# EAGLE schematic Sprite Sail 2 Layer (EAGLE 9.0.0)
Assembly variants: hdmid
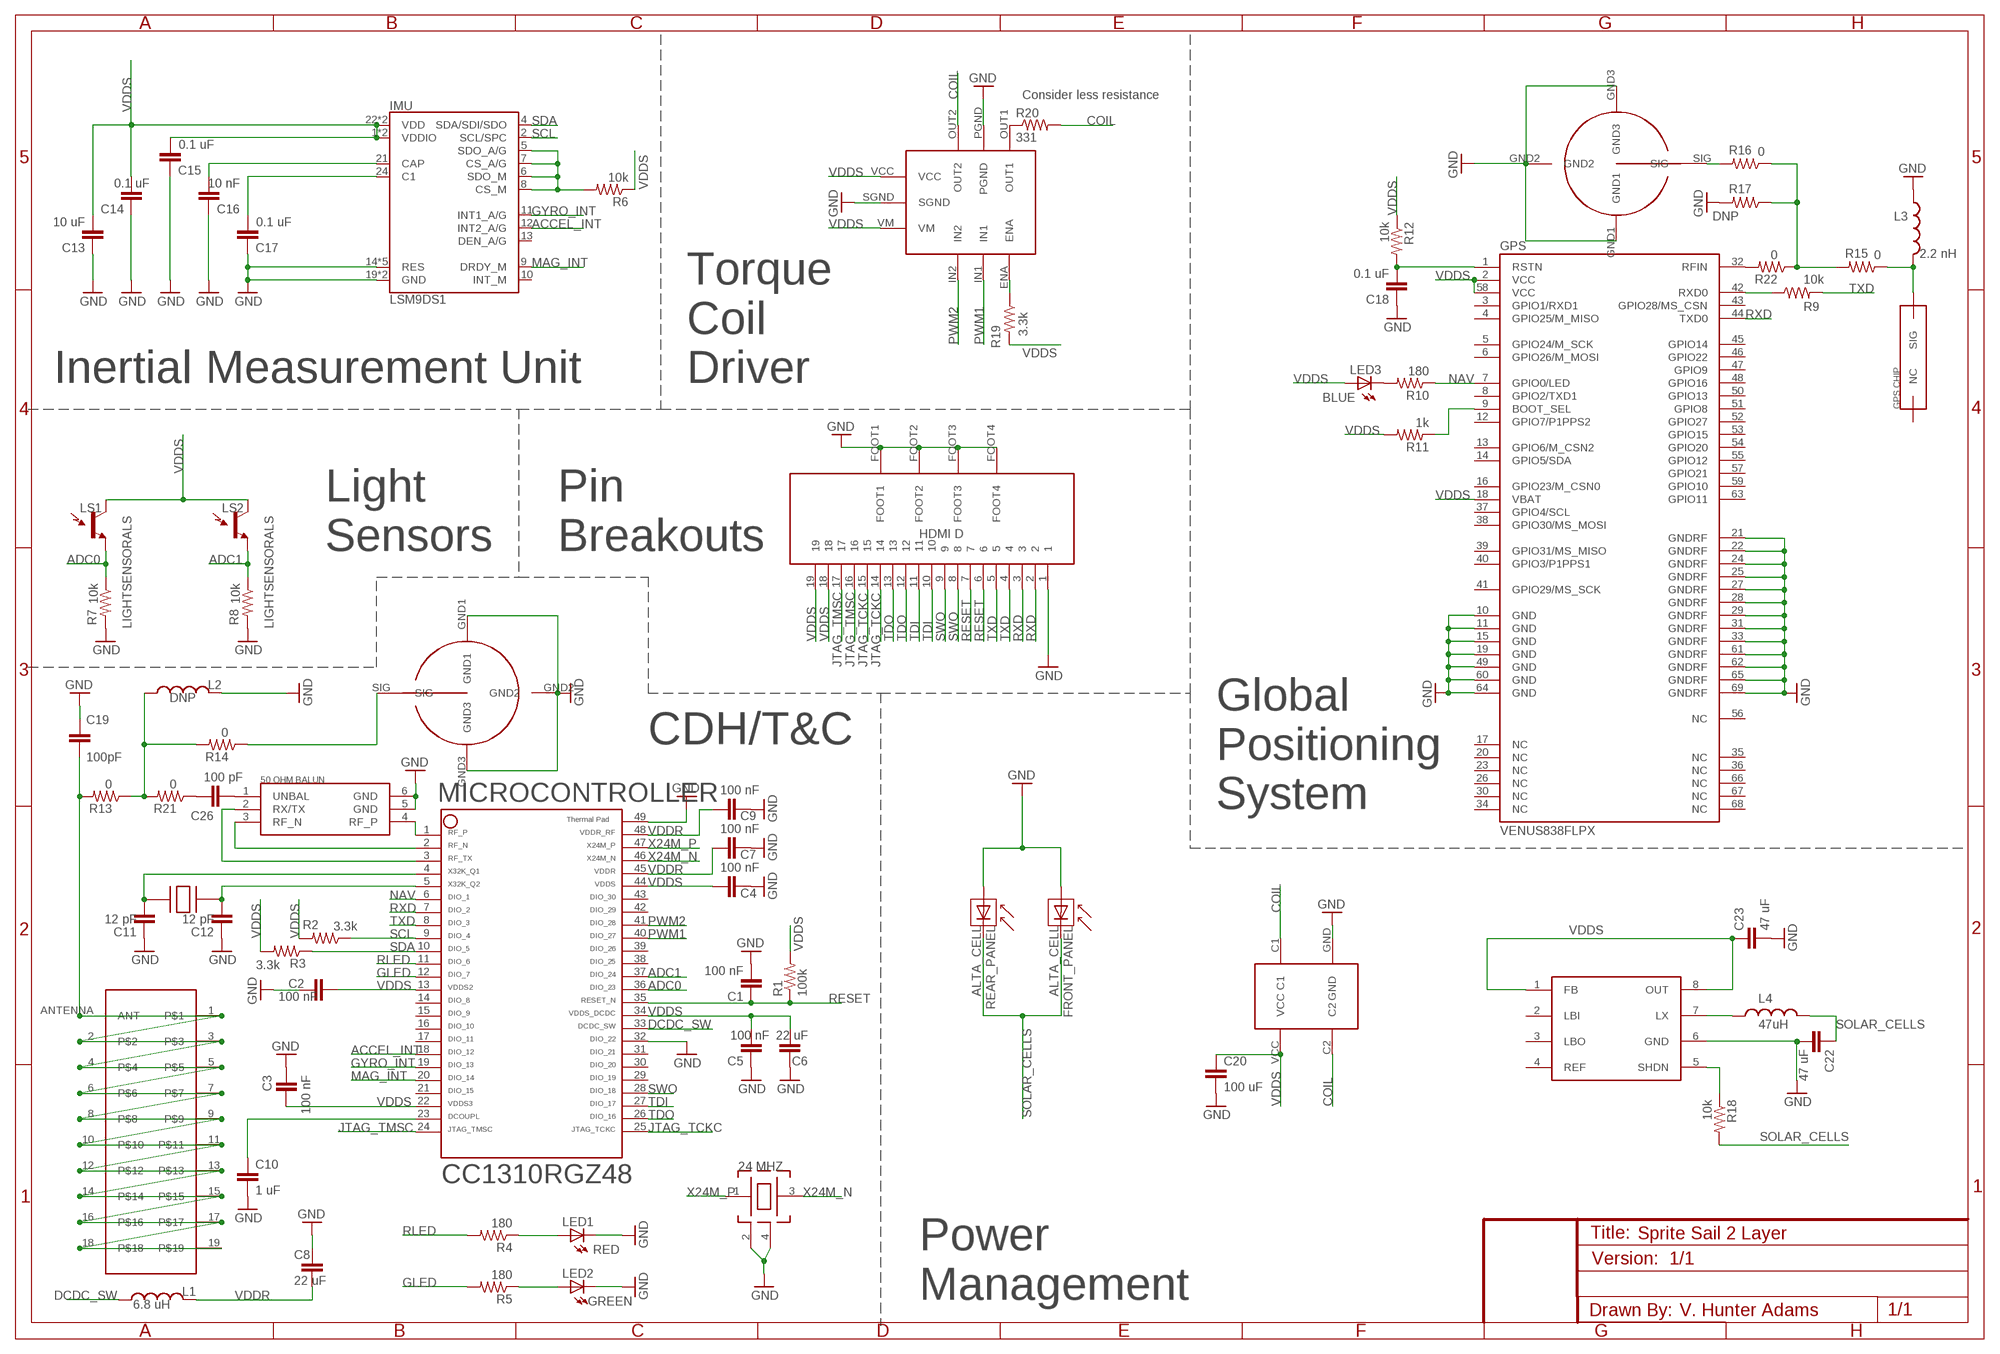
[diagram p0: schematic, sheet 1]

## Parts
32.768  FC-135  [FC-135]
BALUN  JOHANSON_BALUN  [JOHANSON_BALUN]
C1  100 nF  CAP0402-CAP  [0402-CAP]
C2  100 nF  CAP0402-CAP  [0402-CAP]
C3  100 nF  CAP0402-CAP  [0402-CAP]
C4  100 nF  CAP0402-CAP  [0402-CAP]
C5  100 nF  CAP0402-CAP  [0402-CAP]
C6  22 uF  CAP0402-CAP  [0402-CAP]
C7  100 nF  CAP0402-CAP  [0402-CAP]
C8  22 uF  CAP0402-CAP  [0402-CAP]
C9  100 nF  CAP0402-CAP  [0402-CAP]
C10  1 uF  CAP0402-CAP  [0402-CAP]
C11  12 pF  CAP0402-CAP  [0402-CAP]
C12  12 pF  CAP0402-CAP  [0402-CAP]
C13  10 uF  CAP0402-CAP  [0402-CAP]
C14  0.1 uF  CAP0402-CAP  [0402-CAP]
C15  0.1 uF  CAP0402-CAP  [0402-CAP]
C16  10 nF  CAP0402-CAP  [0402-CAP]
C17  0.1 uF  CAP0402-CAP  [0402-CAP]
C18  0.1 uF  CAP0402-CAP  [0402-CAP]
C19  100pF  CAP0603-CAP  [0603-CAP]
C20  100 uF  CAP0805  [0805]
C22  47 uF  CAP0805  [0805]
C23  47 uF  CAP0805  [0805]
C26  100 pF  CAP0402-CAP  [0402-CAP]
FRONT_PANEL  ALTA_CELL  [ALTA_CELL]
GPS  VENUS838FLPX  [VENUS838FLPX]
IMU  LSM9DS1  [LGA24-8X4]
L1  6.8 uH  INDUCTOR0603  [0603]
L2  DNP  INDUCTOR0603  [0603]
L3  2.2 nH  INDUCTOR0603  [0603]
L4  47uH  INDUCTOR0603  [0603]
LED1  RED  LED0603  [LED-0603]
LED2  GREEN  LED0603  [LED-0603]
LED3  BLUE  LED0603  [LED-0603]
LS1  LIGHTSENSORALS  [ALS-PT19]
LS2  LIGHTSENSORALS  [ALS-PT19]
MICROCONTROLLER  CC1310  [CC1310]
R1  100k  RESISTOR0402-RES  [0402-RES]
R2  3.3k  RESISTOR0402-RES  [0402-RES]
R3  3.3k  RESISTOR0402-RES  [0402-RES]
R4  180  RESISTOR0402-RES  [0402-RES]
R5  180  RESISTOR0402-RES  [0402-RES]
R6  10k  RESISTOR0402-RES  [0402-RES]
R7  10k  RESISTOR0402-RES  [0402-RES]
R8  10k  RESISTOR0402-RES  [0402-RES]
R9  10k  RESISTOR0402-RES  [0402-RES]
R10  180  RESISTOR0402-RES  [0402-RES]
R11  1k  RESISTOR0402-RES  [0402-RES]
R12  10k  RESISTOR0402-RES  [0402-RES]
R13  0  RESISTOR0603-RES  [0603-RES]
R14  0  RESISTOR0603-RES  [0603-RES]
R15  0  RESISTOR0603-RES  [0603-RES]
R16  0  RESISTOR0603-RES  [0603-RES]
R17  DNP  RESISTOR0603-RES  [0603-RES]
R18  10k  RESISTOR0402-RES  [0402-RES]
R19  3.3k  RESISTOR0402-RES  [0402-RES]
R20  331  RESISTOR0402-RES  [0402-RES]
R21  0  RESISTOR0603-RES  [0603-RES]
R22  0  RESISTOR0603-RES  [0603-RES]
REAR_PANEL  ALTA_CELL  [ALTA_CELL]
TSX3225  TSX-3225  [TSX-3225]
U$2  LV8417CS  [LV8417CS]
U$3  MM5329-2700  [MM5829-2700]
U$4  PANASONIC_RECTIFIER  [PANASONIC_RECTIFIER]
U$5  JOHANSON_GPS_CHIP  [JOHANSON_GPS_CHIP]
U$6  PCB_ANTENNA  [PCB_ANTENNA]
U$7  MM5329-2700  [MM5829-2700]
U$8  L6920  [L6920]
U$9  HDMID  [HDMID]

## Nets
ACCEL_INT: IMU.12(INT2_A/G) MICROCONTROLLER.18
ADC0: LS1.E(E1) MICROCONTROLLER.36 R7.1
ADC1: LS2.E(E1) MICROCONTROLLER.37 R8.1
ANTENNA: C19.2 R13.2 U$6.1 U$6.2 U$6.3 U$6.4 U$6.5 U$6.6 U$6.7 U$6.8 U$6.9 U$6.10 U$6.11 U$6.12 U$6.13 U$6.14 U$6.15 U$6.16 U$6.17 U$6.18 U$6.19 U$6.ANTENNA(ANT)
COIL: R20.2 U$2.OUT2 U$4.C1 U$4.C2
DCDC_SW: L1.1 MICROCONTROLLER.33
GLED: MICROCONTROLLER.12 R5.2
GND: BALUN.5(GND) BALUN.6(GND) C1.2 C2.2 C3.2 C4.2 C5.2 C6.2 C7.2 C8.2 C9.2 C10.2 C11.2 C12.2 C13.2 C14.2 C15.2 C16.2 C17.2 C18.2 C19.1 C20.2 C22.2 C23.2 FRONT_PANEL.- GPS.10(GND) GPS.11(GND) GPS.15(GND) GPS.19(GND) GPS.21(GNDRF) GPS.22(GNDRF) GPS.24(GNDRF) GPS.25(GNDRF) GPS.27(GNDRF) GPS.28(GNDRF) GPS.29(GNDRF) GPS.31(GNDRF) GPS.33(GNDRF) GPS.49(GND) GPS.60(GND) GPS.61(GNDRF) GPS.62(GNDRF) GPS.64(GND) GPS.65(GNDRF) GPS.69(GNDRF) IMU.14(RES) IMU.15(RES) IMU.16(RES) IMU.17(RES) IMU.18(RES) IMU.19(GND) IMU.20(GND) L2.2 L3.1 LED1.C LED2.C MICROCONTROLLER.32 MICROCONTROLLER.49 R7.2 R8.2 R17.2 REAR_PANEL.- TSX3225.2 TSX3225.4 U$2.PGND U$2.SGND U$3.GND1 U$3.GND2 U$3.GND3 U$4.GND U$7.GND1 U$7.GND2 U$7.GND3 U$8.6(GND) U$9.1 U$9.FOOT1 U$9.FOOT2 U$9.FOOT3 U$9.FOOT4
GYRO_INT: IMU.11(INT1_A/G) MICROCONTROLLER.19
JTAG_TCKC: MICROCONTROLLER.25 U$9.14 U$9.15
JTAG_TMSC: MICROCONTROLLER.24 U$9.16 U$9.17
MAG_INT: IMU.9(DRDY_M) MICROCONTROLLER.20
N$1: C10.1 MICROCONTROLLER.23
N$2: 32.768.P2 C11.1 MICROCONTROLLER.4
N$3: 32.768.P1 C12.1 MICROCONTROLLER.5
N$4: LED1.A R4.1
N$5: LED2.A R5.1
N$6: IMU.5(SDO_A/G) IMU.6(SDO_M) IMU.7(CS_A/G) IMU.8(CS_M) R6.2
N$7: GPS.42(RXD0) R9.1
N$8: C16.1 IMU.21(CAP)
N$9: C17.1 IMU.24(C1)
N$11: LED3.C R10.2
N$12: GPS.9(BOOT_SEL) R11.1
N$13: C18.1 GPS.1(RSTN) R12.2
N$14: R15.2 R16.1 R17.1 R22.1
N$15: L3.2 R15.1 U$5.SIG
N$16: R16.2 U$7.SIG
N$19: R19.1 U$2.ENA
N$20: R20.1 U$2.OUT1
N$21: BALUN.1(UNBAL) C26.2
N$22: BALUN.4(RF_P) MICROCONTROLLER.1
N$23: BALUN.3(RF_N) MICROCONTROLLER.2
N$24: BALUN.2(RX/TX) MICROCONTROLLER.3
N$25: GPS.32(RFIN) R22.2
N$26: L2.1 R13.1 R14.2 R21.2
N$27: C26.1 R21.1
N$40: R14.1 U$3.SIG
N$41: R18.1 U$8.5(SHDN)
N$48: L4.1 U$8.7(LX)
NAV: GPS.7(GPIO0/LED) MICROCONTROLLER.6 R10.1
PWM1: MICROCONTROLLER.40 U$2.IN1
PWM2: MICROCONTROLLER.41 U$2.IN2
RESET: C1.1 MICROCONTROLLER.35 R1.1 U$9.6 U$9.7
RLED: MICROCONTROLLER.11 R4.2
RXD: GPS.44(TXD0) MICROCONTROLLER.7 U$9.2 U$9.3
SCL: IMU.2(SCL/SPC) MICROCONTROLLER.9 R2.1
SDA: IMU.4(SDA/SDI/SDO) MICROCONTROLLER.10 R3.1
SOLAR_CELLS: C22.1 FRONT_PANEL.+ L4.2 R18.2 REAR_PANEL.+
SWO: MICROCONTROLLER.28 U$9.8 U$9.9
TDI: MICROCONTROLLER.27 U$9.10 U$9.11
TDO: MICROCONTROLLER.26 U$9.12 U$9.13
TXD: MICROCONTROLLER.8 R9.2 U$9.4 U$9.5
VDDR: C7.1 C8.1 C9.1 L1.2 MICROCONTROLLER.45 MICROCONTROLLER.48
VDDS: C2.1 C3.1 C4.1 C5.1 C6.1 C13.1 C14.1 C15.1 C20.1 C23.1 GPS.2(VCC) GPS.18(VBAT) GPS.58(VCC) IMU.1(VDDIO) IMU.3(VDDIO) IMU.22(VDD) IMU.23(VDD) LED3.A LS1.C(C1) LS2.C(C1) MICROCONTROLLER.13 MICROCONTROLLER.22 MICROCONTROLLER.34 MICROCONTROLLER.44 R1.2 R2.2 R3.2 R6.1 R11.2 R12.1 R19.2 U$2.VCC U$2.VM U$4.VCC U$8.1(FB) U$8.8(OUT) U$9.18 U$9.19
X24M_N: MICROCONTROLLER.46 TSX3225.3
X24M_P: MICROCONTROLLER.47 TSX3225.1
Unconnected: GPS.3(GPIO1/RXD1) GPS.4(GPIO25/M_MISO) GPS.5(GPIO24/M_SCK) GPS.6(GPIO26/M_MOSI) GPS.8(GPIO2/TXD1) GPS.12(GPIO7/P1PPS2) GPS.13(GPIO6/M_CSN2) GPS.14(GPIO5/SDA) GPS.16(GPIO23/M_CSN0) GPS.17(NC) GPS.20(NC) GPS.23(NC) GPS.26(NC) GPS.30(NC) GPS.34(NC) GPS.35(NC) GPS.36(NC) GPS.37(GPIO4/SCL) GPS.38(GPIO30/MS_MOSI) GPS.39(GPIO31/MS_MISO) GPS.40(GPIO3/P1PPS1) GPS.41(GPIO29/MS_SCK) GPS.43(GPIO28/MS_CSN) GPS.45(GPIO14) GPS.46(GPIO22) GPS.47(GPIO9) GPS.48(GPIO16) GPS.50(GPIO13) GPS.51(GPIO8) GPS.52(GPIO27) GPS.53(GPIO15) GPS.54(GPIO20) GPS.55(GPIO12) GPS.56(NC) GPS.57(GPIO21) GPS.59(GPIO10) GPS.63(GPIO11) GPS.66(NC) GPS.67(NC) GPS.68(NC) IMU.10(INT_M) IMU.13(DEN_A/G) MICROCONTROLLER.14 MICROCONTROLLER.15 MICROCONTROLLER.16 MICROCONTROLLER.17 MICROCONTROLLER.21 MICROCONTROLLER.29 MICROCONTROLLER.30 MICROCONTROLLER.31 MICROCONTROLLER.38 MICROCONTROLLER.39 MICROCONTROLLER.42 MICROCONTROLLER.43 U$5.NC U$8.2(LBI) U$8.3(LBO) U$8.4(REF)

## Notes on the sheet
- Consider less resistance
- Inertial Measurement Unit
- Torque
  Coil
  Driver
- Light
  Sensors
- Pin
  Breakouts
- CDH/T&C
- Global
  Positioning
  System
- Power
  Management

## Library data of the parts
32.768 = FC-135:FC-135: FC-135 32.768KA-AG0
BALUN = JOHANSON_BALUN:JOHANSON_BALUN
C1-C20 C22 C23 C26 = SparkFun:CAP: Capacitor Standard 0603 ceramic capacitor, and 0.1" leaded capacitor.
FRONT_PANEL REAR_PANEL = ALTA_CELL:ALTA_CELL
GPS = VENUS838FLPX:VENUS838FLPX: Venus838FLPx-L
IMU = SparkFun-Sensors:LSM9DS1: LSM9DS1 3D accelerometer, gyroscope & magnetometer The LSM9DS1 is a system-in-package featuring a 3D digital linear acceleration sensor, a 3D digital angular rate sensor, and a 3D digital magnetic sensor. The LSM9DS1 has a linear acceleration full scale of ±2g/±4g/±8/±16 g, a magnetic field full scale of ±4/±8/±12/±16 gauss and an angular rate of ±245/±500/±2000 dps. The LSM9DS1 includes an I2 C serial bus interface supporting standard and fast mode (100 kHz and 400 kHz) and an SPI serial standard interface. Magnetic, accelerometer and gyroscope sensing can be enabled or set in power-down mode separately for smart power management. The LSM9DS1 is available in a plastic land grid array package (LGA) and it is guaranteed to operate over an extended temperature range from -40 °C to +85 °C.; PROD_ID: IC-12536
L1-L4 = SparkFun:INDUCTOR: Inductors Basic Inductor/Choke - 0603 and 1206. Footprints are not proven and vary greatly between part numbers.
LED1-LED3 = SparkFun:LED: LEDs Standard schematic elements and footprints for 5mm, 3mm, 1206, and 0603 sized LEDs. 5mm - Spark Fun Electronics SKU : COM-00529 (and others)
LS1 LS2 = SparkFun-Sensors:LIGHTSENSOR: Ambient Light Sensor Simple light detection sensor. Output varies with light intensity input. Spark Fun Electronics SKU : COM-08348; PROD_ID: IC-11836
MICROCONTROLLER = CC1310RGZ48:CC1310: CC1310 RGZ48 package
R1-R22 = SparkFun:RESISTOR: Resistor Basic schematic elements and footprints for 0603, 1206, and PTH resistors.
TSX3225 = TSX-3225:TSX-3225
U$2 = LV8417CS:LV8417CS
U$3 U$7 = MM5329-2700:MM5329-2700
U$4 = Panasonic_Rectifier:PANASONIC_RECTIFIER
U$5 = johanson_gps_chip:JOHANSON_GPS_CHIP
U$6 = PCB_ANTENNA:PCB_ANTENNA
U$8 = L6920:L6920
U$9 = HDMID:HDMID